# EAGLE design Toll_Controller_Unit_1st_Iteration (EAGLE 9.6.2)
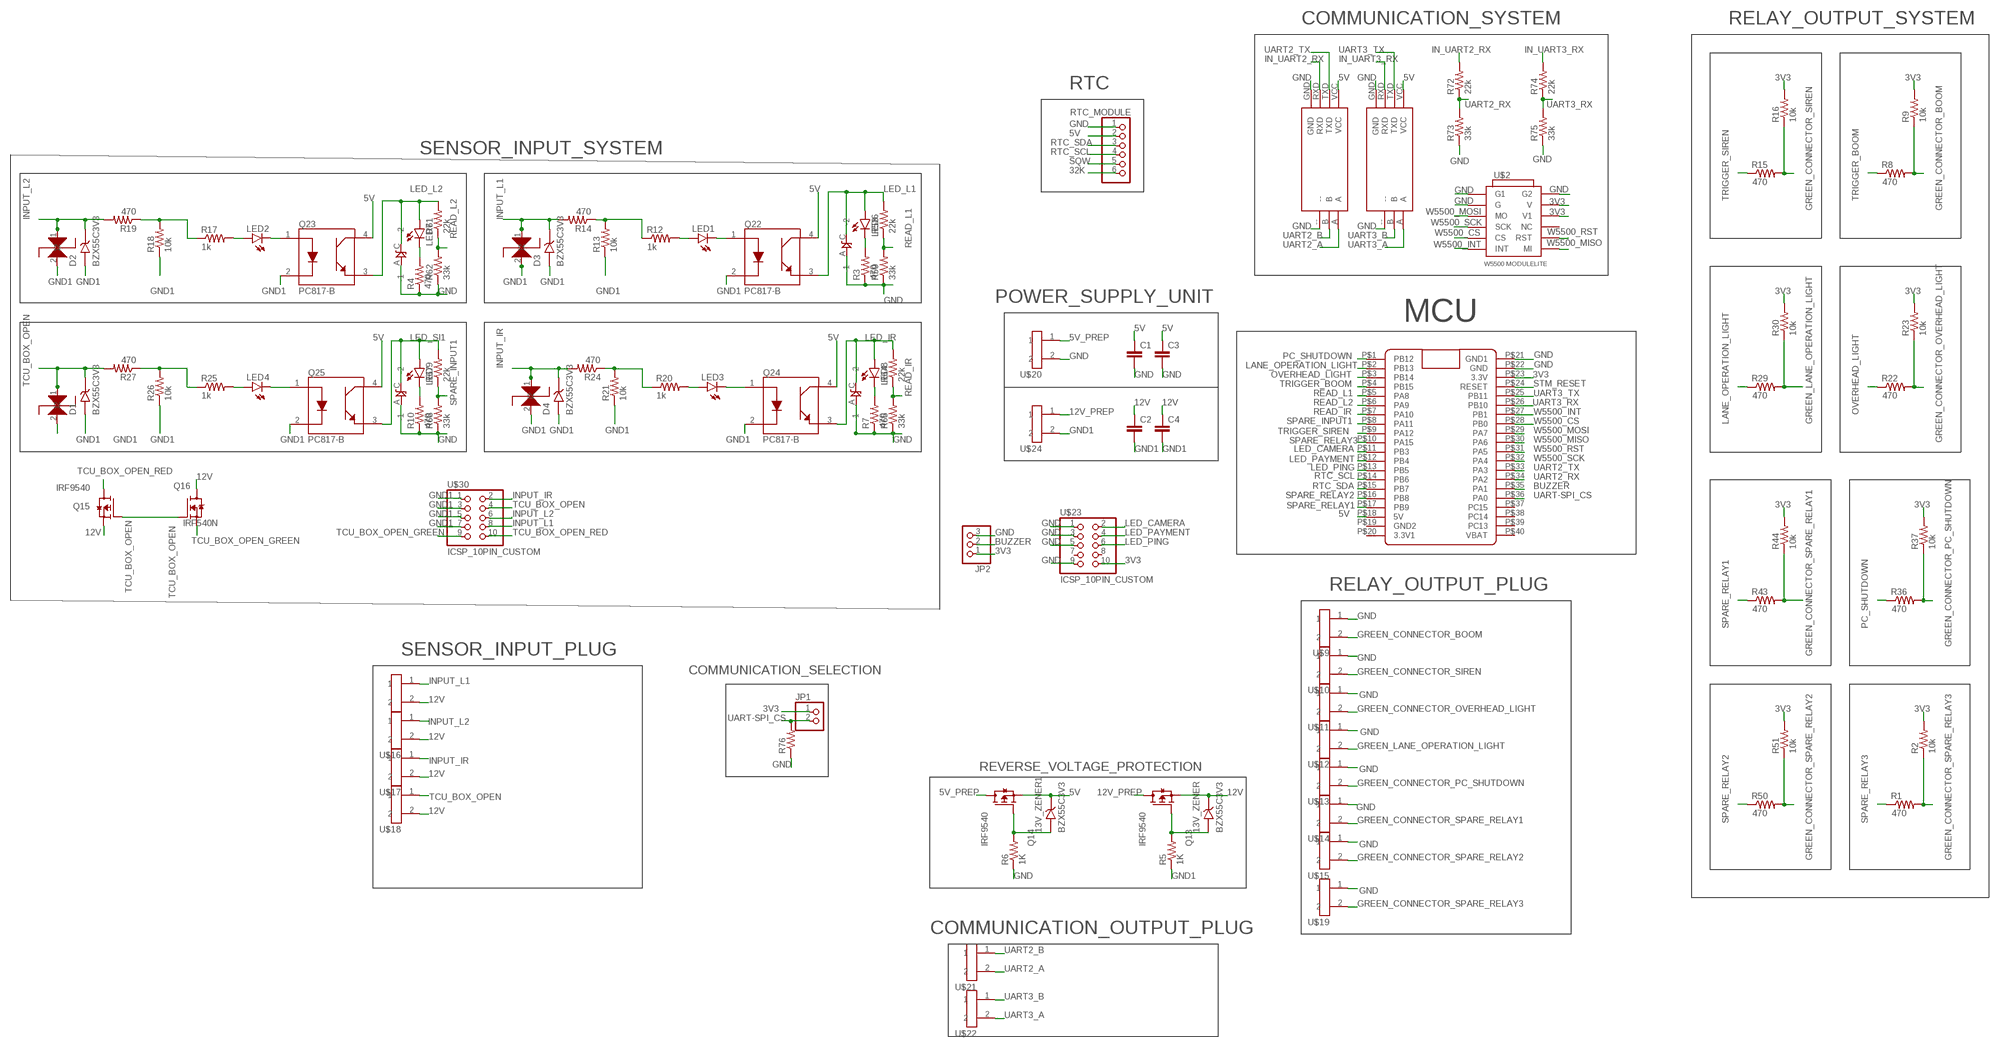
[diagram p0: schematic, sheet 1]

## Parts
13V_ZENER  BZX55C3V3  [DIOAD928W47L399D179]
13V_ZENER1  BZX55C3V3  [DIOAD928W47L399D179]
C1  CAPACITOR  [CAPACITOR]
C2  CAPACITOR  [CAPACITOR]
C3  CAPACITOR  [CAPACITOR]
C4  CAPACITOR  [CAPACITOR]
D1  BZX55C3V3  [DIOAD928W47L399D179]
D2  BZX55C3V3  [DIOAD928W47L399D179]
D3  BZX55C3V3  [DIOAD928W47L399D179]
D4  BZX55C3V3  [DIOAD928W47L399D179]
JP1  PINHD-1X2  [1X02]
JP2  PINHD-1X3  [1X03]
LED1  LED  [LED]
LED2  LED  [LED]
LED3  LED  [LED]
LED4  LED  [LED]
LED6  LED  [LED]
LED7  LED  [LED]
LED8  LED  [LED]
LED9  LED  [LED]
Q13  IRF9540  [TO254P1052X465X1989-3]
Q14  IRF9540  [TO254P1052X465X1989-3]
Q15  IRF9540  [TO254P1052X465X1989-3]
Q16  IRF540N  [TO254P1054X469X1930-3]
Q22  PC817-B  [DIP762W50P254L650H455Q4B]
Q23  PC817-B  [DIP762W50P254L650H455Q4B]
Q24  PC817-B  [DIP762W50P254L650H455Q4B]
Q25  PC817-B  [DIP762W50P254L650H455Q4B]
R1  470  RESISTOR  [RESISTOR]
R2  10k  RESISTOR  [RESISTOR]
R3  470  RESISTOR  [RESISTOR]
R4  470  RESISTOR  [RESISTOR]
R5  1K  RESISTOR  [RESISTOR]
R6  1K  RESISTOR  [RESISTOR]
R7  470  RESISTOR  [RESISTOR]
R8  470  RESISTOR  [RESISTOR]
R9  10k  RESISTOR  [RESISTOR]
R10  470  RESISTOR  [RESISTOR]
R12  1k  RESISTOR  [RESISTOR]
R13  10k  RESISTOR  [RESISTOR]
R14  470  RESISTOR  [RESISTOR]
R15  470  RESISTOR  [RESISTOR]
R16  10k  RESISTOR  [RESISTOR]
R17  1k  RESISTOR  [RESISTOR]
R18  10k  RESISTOR  [RESISTOR]
R19  470  RESISTOR  [RESISTOR]
R20  1k  RESISTOR  [RESISTOR]
R21  10k  RESISTOR  [RESISTOR]
R22  470  RESISTOR  [RESISTOR]
R23  10k  RESISTOR  [RESISTOR]
R24  470  RESISTOR  [RESISTOR]
R25  1k  RESISTOR  [RESISTOR]
R26  10k  RESISTOR  [RESISTOR]
R27  470  RESISTOR  [RESISTOR]
R29  470  RESISTOR  [RESISTOR]
R30  10k  RESISTOR  [RESISTOR]
R36  470  RESISTOR  [RESISTOR]
R37  10k  RESISTOR  [RESISTOR]
R43  470  RESISTOR  [RESISTOR]
R44  10k  RESISTOR  [RESISTOR]
R50  470  RESISTOR  [RESISTOR]
R51  10k  RESISTOR  [RESISTOR]
R58  22k  RESISTOR  [RESISTOR]
R59  33k  RESISTOR  [RESISTOR]
R61  22k  RESISTOR  [RESISTOR]
R62  33k  RESISTOR  [RESISTOR]
R64  22k  RESISTOR  [RESISTOR]
R65  33k  RESISTOR  [RESISTOR]
R67  22k  RESISTOR  [RESISTOR]
R68  33k  RESISTOR  [RESISTOR]
R72  22k  RESISTOR  [RESISTOR]
R73  33k  RESISTOR  [RESISTOR]
R74  22k  RESISTOR  [RESISTOR]
R75  33k  RESISTOR  [RESISTOR]
R76  RESISTOR  [RESISTOR]
RTC_MODULE  PINHD-1X6  [1X06]
STM_BLUEPILL  BLUE_PILL  [BLUE_PILL]
U$1  1N227B  [1N227B]
U$2  W5500_MODULELITE  [W5500_MODULELITE]
U$3  1N227B  [1N227B]
U$4  1N227B  [1N227B]
U$5  1N227B  [1N227B]
U$6  GREEN_PLUG_90_2  [GREEN_PLUG_90_2]
U$7  RS485_CHINESE  [RS485_CHINESE]
U$8  RS485_CHINESE  [RS485_CHINESE]
U$9  GREEN_PLUG_90_2  [GREEN_PLUG_90_2]
U$10  GREEN_PLUG_90_2  [GREEN_PLUG_90_2]
U$11  GREEN_PLUG_90_2  [GREEN_PLUG_90_2]
U$12  GREEN_PLUG_90_2  [GREEN_PLUG_90_2]
U$13  GREEN_PLUG_90_2  [GREEN_PLUG_90_2]
U$14  GREEN_PLUG_90_2  [GREEN_PLUG_90_2]
U$15  GREEN_PLUG_90_2  [GREEN_PLUG_90_2]
U$16  GREEN_PLUG_90_2  [GREEN_PLUG_90_2]
U$17  GREEN_PLUG_90_2  [GREEN_PLUG_90_2]
U$18  GREEN_PLUG_90_2  [GREEN_PLUG_90_2]
U$19  GREEN_PLUG_90_2  [GREEN_PLUG_90_2]
U$20  GREEN_PLUG_90_2  [GREEN_PLUG_90_2]
U$21  GREEN_PLUG_90_2  [GREEN_PLUG_90_2]
U$22  GREEN_PLUG_90_2  [GREEN_PLUG_90_2]
U$23  ICSP_10PIN_CUSTOM  [ICSP_10PIN_CUSTOM]
U$24  GREEN_PLUG_90_2  [GREEN_PLUG_90_2]
U$25  1KE100A_CUSTOM  [1KE100A_CUSTOM]
U$26  1KE100A_CUSTOM  [1KE100A_CUSTOM]
U$27  1KE100A_CUSTOM  [1KE100A_CUSTOM]
U$28  1KE100A_CUSTOM  [1KE100A_CUSTOM]
U$30  ICSP_10PIN_CUSTOM  [ICSP_10PIN_CUSTOM]

## Nets
3V3: JP1.1 JP2.1 R2.2 R9.2 R16.2 R23.2 R30.2 R37.2 R44.2 R51.2 STM_BLUEPILL.P$23(3.3V) U$2.V U$2.V1 U$23.10
5V: 13V_ZENER1.C(K) C1.1 C3.1 Q14.3(S) Q22.4(COLLECTOR) Q23.4(COLLECTOR) Q24.4(COLLECTOR) Q25.4(COLLECTOR) RTC_MODULE.2 STM_BLUEPILL.P$18(5V) U$7.VCC U$8.VCC
5V_PREP: Q14.2(D) U$20.1
12V: 13V_ZENER.C(K) C2.1 C4.1 Q13.3(S) Q15.3(S) Q16.2(D) U$6.2 U$16.2 U$17.2 U$18.2
12V_PREP: Q13.2(D) U$24.1
32K: RTC_MODULE.6
BUZZER: JP2.2 STM_BLUEPILL.P$35(PA1)
GND: C1.2 C3.2 JP2.3 R3.1 R4.1 R6.1 R7.1 R10.1 R59.1 R62.1 R65.1 R68.1 R73.1 R75.1 R76.1 RTC_MODULE.1 STM_BLUEPILL.P$21(GND1) STM_BLUEPILL.P$22(GND) U$1.A(-1) U$2.G U$2.G1 U$2.G2 U$3.A(-1) U$4.A(-1) U$5.A(-1) U$7.-- U$7.GND U$8.-- U$8.GND U$9.1 U$10.1 U$11.1 U$12.1 U$13.1 U$14.1 U$15.1 U$19.1 U$20.2 U$23.1 U$23.3 U$23.5 U$23.9
GND1: C2.2 C4.2 D1.A D2.A D3.A D4.A Q22.2(CATHODE) Q23.2(CATHODE) Q24.2(CATHODE) Q25.2(CATHODE) R5.1 R13.1 R18.1 R21.1 R26.1 U$24.2 U$25.2 U$26.2 U$30.1 U$30.3 U$30.5 U$30.7
GREEN_CONNECTOR_BOOM: R8.2 R9.1 U$9.2
GREEN_CONNECTOR_OVERHEAD_LIGHT: R22.2 R23.1 U$11.2
GREEN_CONNECTOR_PC_SHUTDOWN: R36.2 R37.1 U$13.2
GREEN_CONNECTOR_SIREN: R15.2 R16.1 U$10.2
GREEN_CONNECTOR_SPARE_RELAY1: R43.2 R44.1 U$14.2
GREEN_CONNECTOR_SPARE_RELAY2: R50.2 R51.1 U$15.2
GREEN_CONNECTOR_SPARE_RELAY3: R1.2 R2.1 U$19.2
GREEN_LANE_OPERATION_LIGHT: R29.2 R30.1 U$12.2
IN_UART2_RX: R72.2 U$8.RXD
IN_UART3_RX: R74.2 U$7.RXD
INPUT_IR: D4.C(K) R24.2 U$17.1 U$27.1 U$30.2
INPUT_L1: D3.C(K) R14.2 U$6.1 U$25.1 U$30.8
INPUT_L2: D2.C(K) R19.2 U$16.1 U$28.1 U$30.6
LANE_OPERATION_LIGHT: R29.1 STM_BLUEPILL.P$2(PB13)
LED_CAMERA: STM_BLUEPILL.P$11(PB3) U$23.2
LED_IR: LED8.A Q24.3(EMITTER) R64.2 U$4.C(-2)
LED_L1: LED6.A Q22.3(EMITTER) R58.2 U$1.C(-2)
LED_L2: LED7.A Q23.3(EMITTER) R61.2 U$3.C(-2)
LED_PAYMENT: STM_BLUEPILL.P$12(PB4) U$23.4
LED_PING: STM_BLUEPILL.P$13(PB5) U$23.6
LED_SI1: LED9.A Q25.3(EMITTER) R67.2 U$5.C(-2)
N$2: 13V_ZENER1.A Q14.1(G) R6.2
N$3: 13V_ZENER.A Q13.1(G) R5.2
N$4: LED6.K(C) R3.2
N$7: LED7.K(C) R4.2
N$8: LED8.K(C) R7.2
N$10: LED9.K(C) R10.2
N$14: LED1.A R12.2
N$16: R12.1 R13.2 R14.1
N$18: LED2.A R17.2
N$20: R17.1 R18.2 R19.1
N$22: LED3.A R20.2
N$24: R20.1 R21.2 R24.1
N$25: R25.1 R26.2 R27.1
N$26: LED4.A R25.2
N$33: LED1.K(C) Q22.1(ANODE)
N$34: LED3.K(C) Q24.1(ANODE)
N$35: LED4.K(C) Q25.1(ANODE)
N$36: LED2.K(C) Q23.1(ANODE)
OVERHEAD_LIGHT: R22.1 STM_BLUEPILL.P$3(PB14)
PC_SHUTDOWN: R36.1 STM_BLUEPILL.P$1(PB12)
READ_IR: R64.1 R65.2 STM_BLUEPILL.P$7(PA10)
READ_L1: R58.1 R59.2 STM_BLUEPILL.P$5(PA8)
READ_L2: R61.1 R62.2 STM_BLUEPILL.P$6(PA9)
RTC_SCL: RTC_MODULE.4 STM_BLUEPILL.P$14(PB6)
RTC_SDA: RTC_MODULE.3 STM_BLUEPILL.P$15(PB7)
SPARE_INPUT1: R67.1 R68.2 STM_BLUEPILL.P$8(PA11)
SPARE_RELAY1: R43.1 STM_BLUEPILL.P$17(PB9)
SPARE_RELAY2: R50.1 STM_BLUEPILL.P$16(PB8)
SPARE_RELAY3: R1.1 STM_BLUEPILL.P$10(PA15)
SQW: RTC_MODULE.5
STM_RESET: STM_BLUEPILL.P$24(RESET)
TCU_BOX_OPEN: D1.C(K) Q15.1(G) Q16.1(G) R27.2 U$18.1 U$26.1 U$30.4
TCU_BOX_OPEN_GREEN: Q16.3(S) U$30.9
TCU_BOX_OPEN_RED: Q15.2(D) U$30.10
TRIGGER_BOOM: R8.1 STM_BLUEPILL.P$4(PB15)
TRIGGER_SIREN: R15.1 STM_BLUEPILL.P$9(PA12)
UART2_A: U$8.A U$21.2
UART2_B: U$8.B U$21.1
UART2_RX: R72.1 R73.2 STM_BLUEPILL.P$34(PA2)
UART2_TX: STM_BLUEPILL.P$33(PA3) U$8.TXD
UART3_A: U$7.A U$22.2
UART3_B: U$7.B U$22.1
UART3_RX: R74.1 R75.2 STM_BLUEPILL.P$26(PB10)
UART3_TX: STM_BLUEPILL.P$25(PB11) U$7.TXD
UART-SPI_CS: JP1.2 R76.2 STM_BLUEPILL.P$36(PA0)
W5500_CS: STM_BLUEPILL.P$28(PB0) U$2.CS
W5500_INT: STM_BLUEPILL.P$27(PB1) U$2.INT
W5500_MISO: STM_BLUEPILL.P$30(PA6) U$2.MI
W5500_MOSI: STM_BLUEPILL.P$29(PA7) U$2.MO
W5500_RST: STM_BLUEPILL.P$31(PA5) U$2.RST
W5500_SCK: STM_BLUEPILL.P$32(PA4) U$2.SCK
Unconnected: STM_BLUEPILL.P$19(GND2) STM_BLUEPILL.P$20(3.3V1) STM_BLUEPILL.P$37(PC15) STM_BLUEPILL.P$38(PC14) STM_BLUEPILL.P$39(PC13) STM_BLUEPILL.P$40(VBAT) U$2.NC U$23.7 U$23.8 U$27.2 U$28.2

## Notes on the sheet
- COMMUNICATION_SYSTEM | RELAY_OUTPUT_SYSTEM
- RTC
- SENSOR_INPUT_SYSTEM
- POWER_SUPPLY_UNIT
- MCU
- RELAY_OUTPUT_PLUG
- SENSOR_INPUT_PLUG
- COMMUNICATION_SELECTION
- REVERSE_VOLTAGE_PROTECTION
- COMMUNICATION_OUTPUT_PLUG

## Library data of the parts
13V_ZENER 13V_ZENER1 D1-D4 = BZX55C3V3:BZX55C3V3: Check availability <https://pricing.snapeda.com/parts/BZX55C3V3-TR/Vishay%20Semiconductor/view-part?ref=eda>; AVAILABILITY: In Stock; CHECK_PRICES: https://www.snapeda.com/parts/BZX55C3V3-TR/Vishay/view-part/?ref=eda; DESCRIPTION: Zener Diode 3.3 V 500 mW ±6% Through Hole DO-204AH (DO-35); MF: Vishay Semiconductor; MP: BZX55C3V3-TR; PACKAGE: DO-35 NXP Semiconductors; PRICE: None; SNAPEDA_LINK: https://www.snapeda.com/parts/BZX55C3V3-TR/Vishay/view-part/?ref=snap
C1-C4 = Hand_Solder:CAPACITOR: Hand Solder Capacitor
JP1 = pinhead:PINHD-1X2: PIN HEADER
JP2 = pinhead:PINHD-1X3: PIN HEADER
LED1-LED4 LED6-LED9 = Hand_Solder:LED: LED HAND SOLDER
Q13-Q15 = IRF9540:IRF9540: Trans MOSFET P-CH 100V 6.8A 3-Pin(3+Tab) TO-220AB Check availability <https://pricing.snapeda.com/parts/IRF9540/Vishay%20Siliconix/view-part?ref=eda>; AVAILABILITY: In Stock; CHECK_PRICES: https://www.snapeda.com/parts/IRF9540/Vishay/view-part/?ref=eda; DESCRIPTION: P-Channel 100 V 19A (Tc) 3.7W (Ta), 150W (Tc) Surface Mount D²PAK (TO-263); MF: Vishay Siliconix; MP: IRF9540; PACKAGE: TO-220-3 Vishay; PRICE: None; SNAPEDA_LINK: https://www.snapeda.com/parts/IRF9540/Vishay/view-part/?ref=snap
Q16 = IRF540N:IRF540N: Check availability <https://pricing.snapeda.com/parts/IRF540N/Infineon%20Technologies/view-part?ref=eda>; AVAILABILITY: In Stock; CHECK_PRICES: https://www.snapeda.com/parts/IRF540N/Infineon/view-part/?ref=eda; DESCRIPTION: Transistor NPN MOS IRF540/IRF540N INTERNATIONAL RECTIFIER Ampere=28 V=100 TO220; MF: Infineon Technologies; MP: IRF540N; PACKAGE: Package; PRICE: None; SNAPEDA_LINK: https://www.snapeda.com/parts/IRF540N/Infineon/view-part/?ref=snap
Q22-Q25 = PC817-B:PC817-B: Check availability <https://pricing.snapeda.com/parts/PC817-B/American%20Bright/view-part?ref=eda>; AVAILABILITY: Not in stock; CHECK_PRICES: https://www.snapeda.com/parts/PC817-B/American+Bright/view-part/?ref=eda; DESCRIPTION: Phototransistors 4-DIP (0.300, 7.62mm); MF: American Bright; MP: PC817-B; PACKAGE: DIP-4 American Bright; PRICE: None; SNAPEDA_LINK: https://www.snapeda.com/parts/PC817-B/American+Bright/view-part/?ref=snap
R1-R10 R12-R27 R29 R30 R36 R37 R43 R44 R50 R51 R58 R59 R61 R62 R64 R65 R67 R68 R72-R76 = Hand_Solder:RESISTOR: Hand Solder Resistor
RTC_MODULE = pinhead:PINHD-1X6: PIN HEADER
STM_BLUEPILL = BluePill:BLUE_PILL
U$1 U$3-U$5 = 1N5227B:1N227B
U$2 = W5500_ModuleLite:W5500_MODULELITE: A custom W5500 Modulelite library made from using the datasheet link: https://nettigo.eu/products/ethernet-module-wiznet-w5500-usr-es1-w5500-lite
U$6 U$9-U$22 U$24 = Green_plug_90:GREEN_PLUG_90_2
U$7 U$8 = RS485_MOD:RS485_CHINESE
U$23 U$30 = ISCP_10PIN_CUSTOM:ICSP_10PIN_CUSTOM
U$25-U$28 = 1KE100A_CUSTOM:1KE100A_CUSTOM

## Board
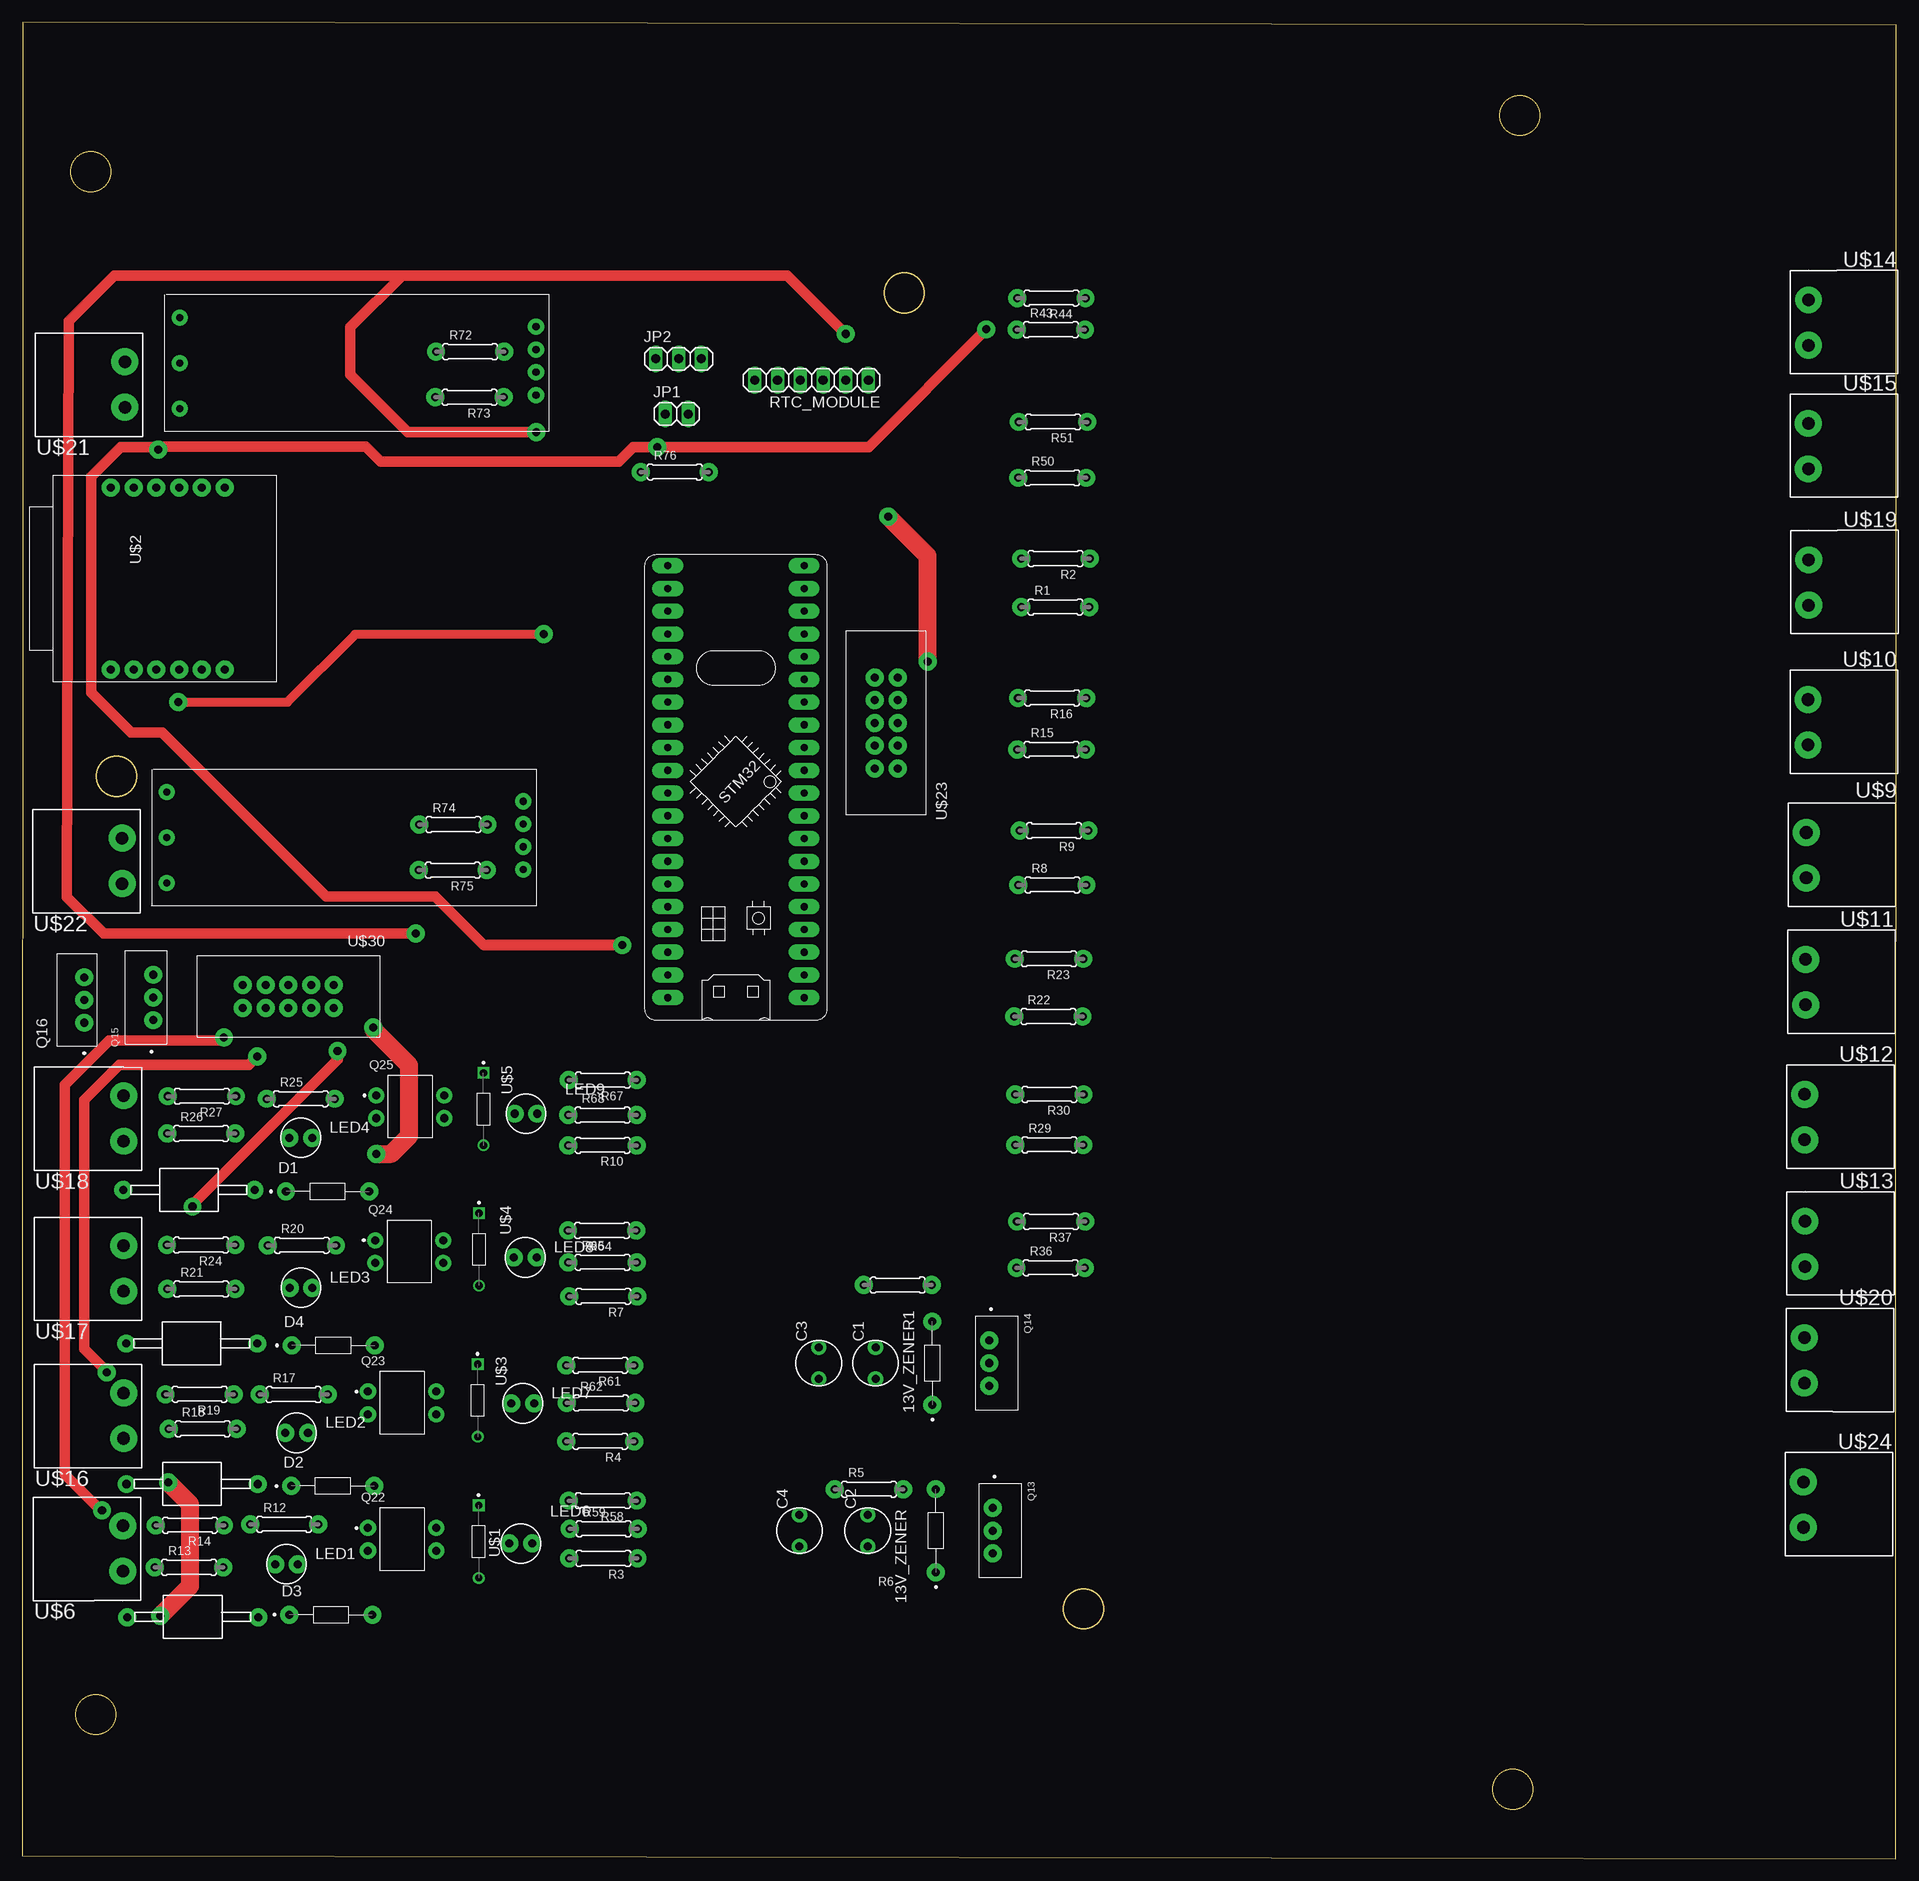
[diagram p1: board, top side]
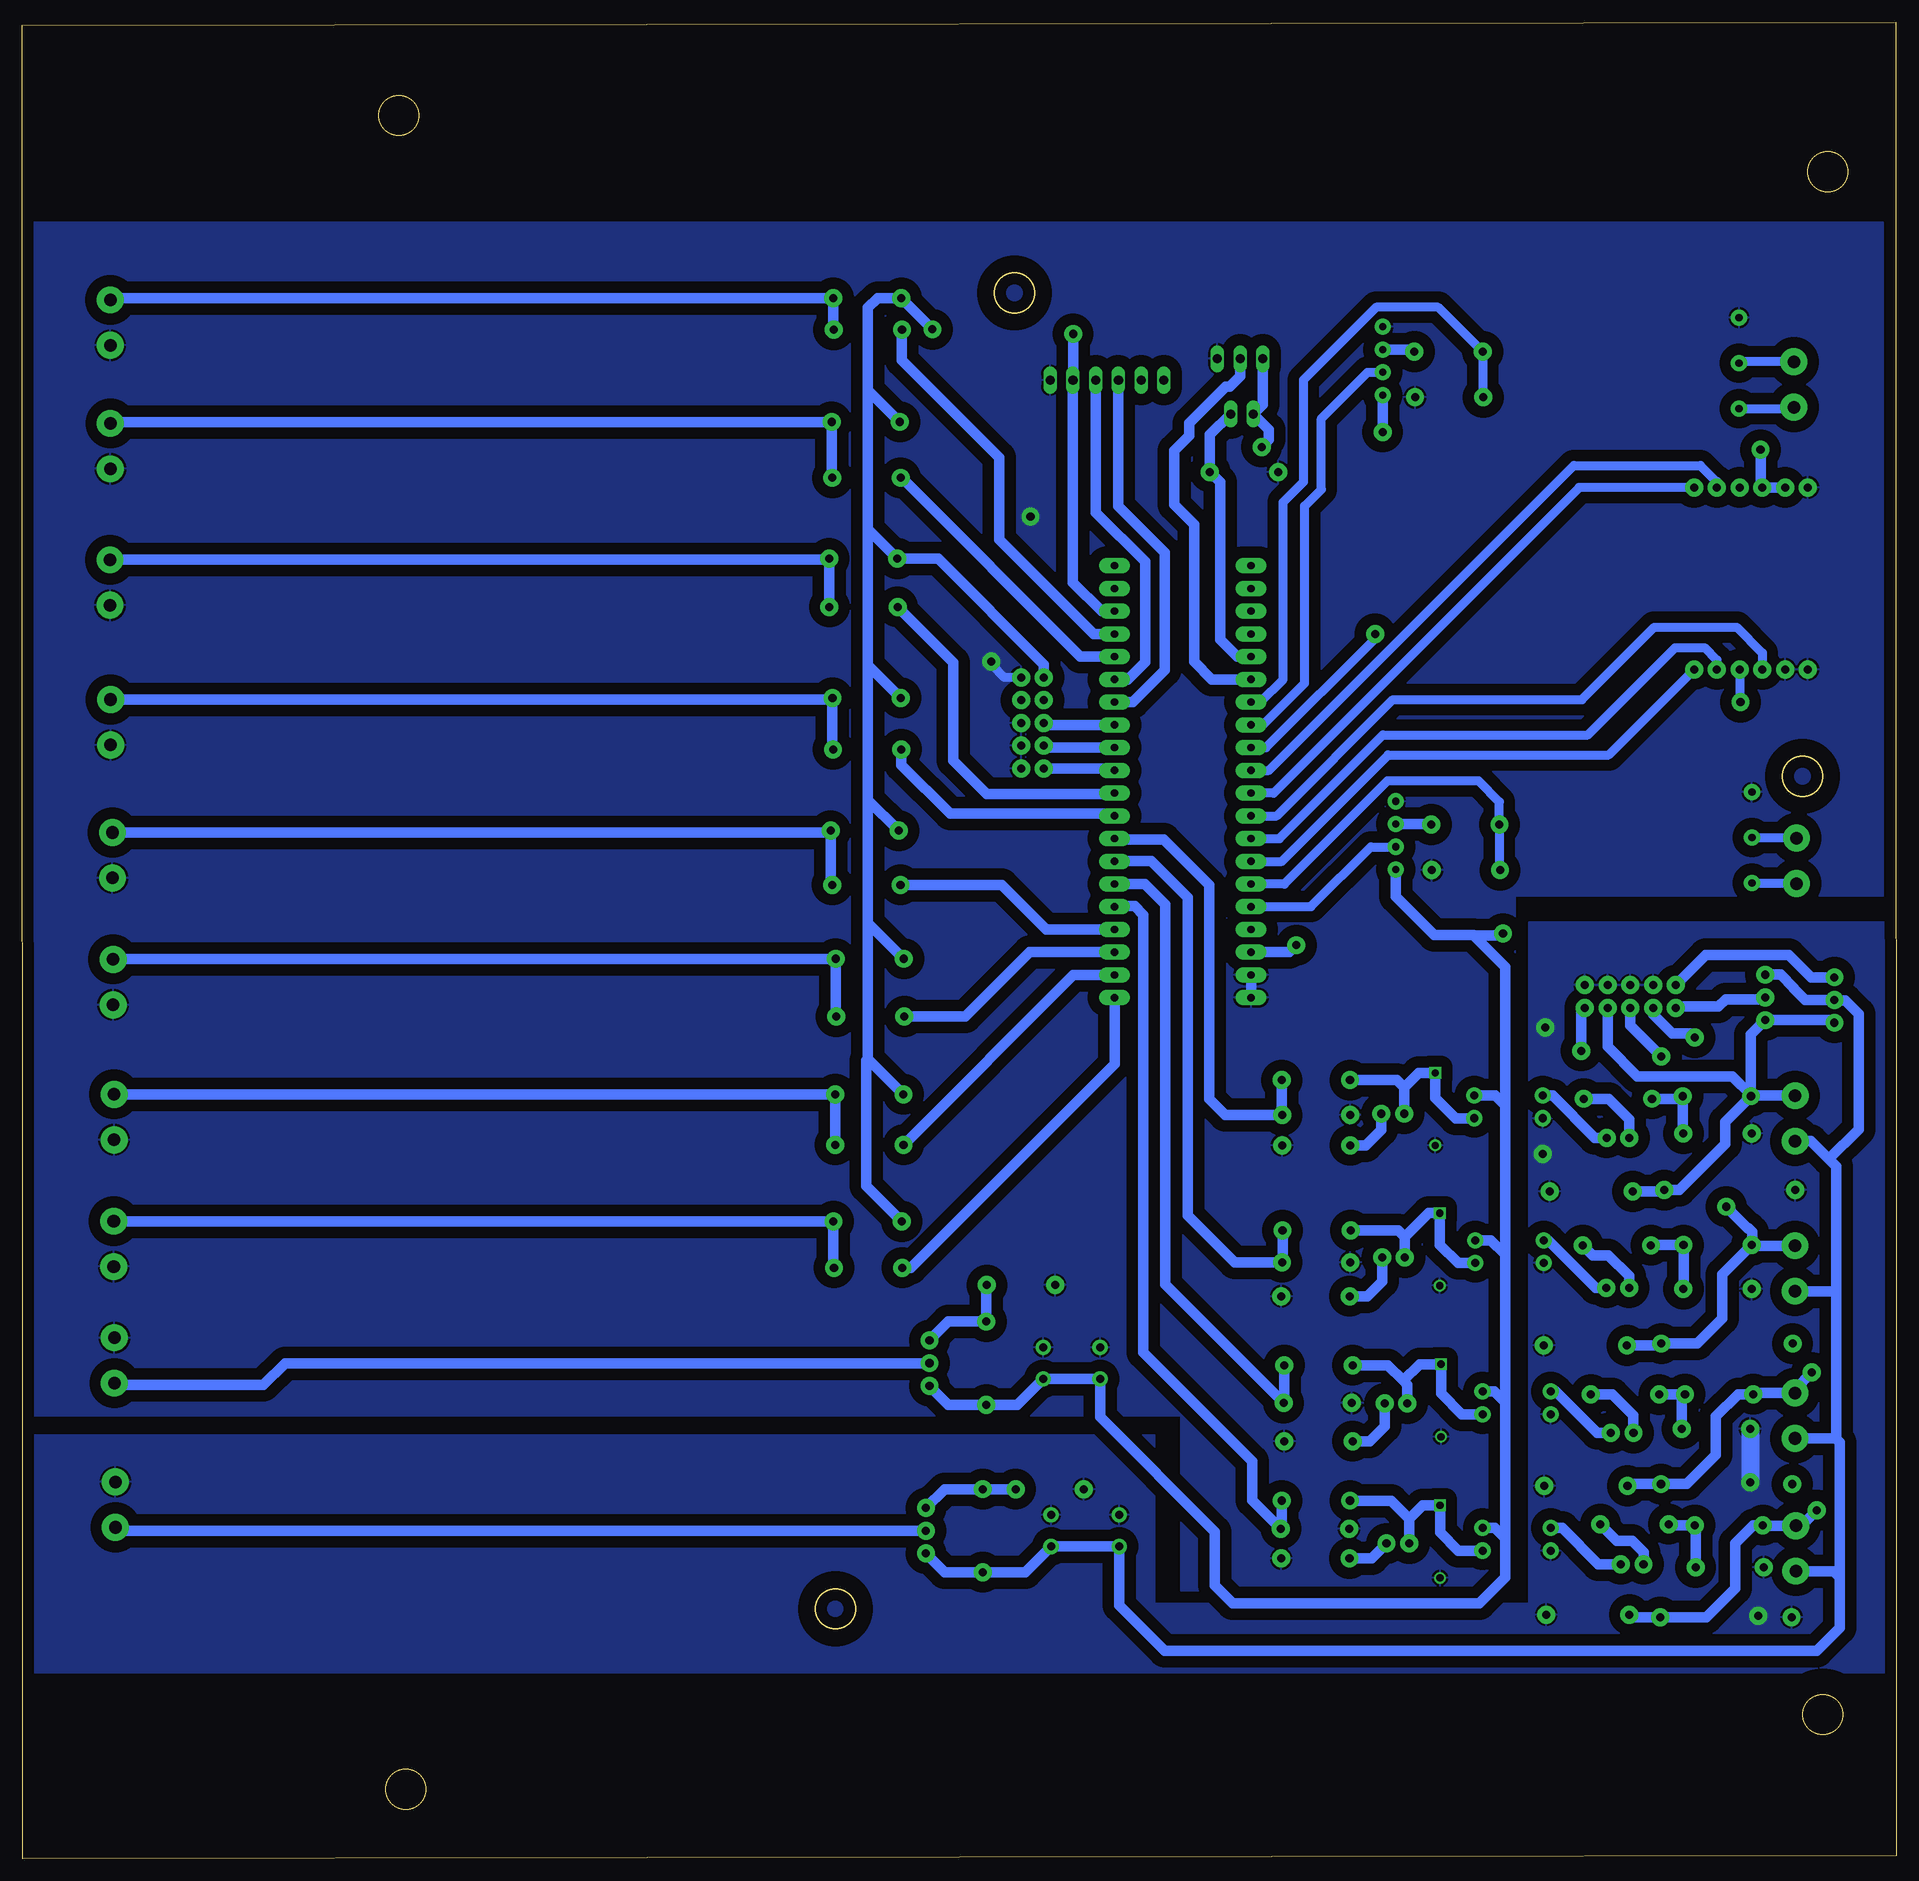
[diagram p2: board, bottom side, seen from below]

Size 209.29 x 205.13 mm. Coordinates in mm from the lower left corner, seen from the top.
Outline: 0,0.32 209.24,0 209.29,204.81 0.05,205.13 0,0.32
Outline: circle at 98.49,174.9 radius 2.24
Outline: circle at 118.49,27.9 radius 2.24
Outline: circle at 10.49,120.9 radius 2.24
Outline: circle at 8.21,16.09 radius 2.24
Outline: circle at 7.65,188.43 radius 2.24
Outline: circle at 167.24,194.73 radius 2.24
Outline: circle at 166.45,7.72 radius 2.24
Copper layers (1*16): Top 0.035mm / dielectric 1.5mm / Bottom 0.035mm
Design rules "default *": minimum track width 1mm, minimum drill 0.35mm, track to track 1mm, track to pad 0.5mm, pad to pad 0.5mm, via to via 0.5mm, smd to smd 6mil, copper to edge 40mil, drill to drill 6mil, minimum pad ring 10mil, minimum via ring 8mil, stop-mask expansion 4mil, vias tented up to drill 0mil, thermal gap 10mil
tRestrict: area 95.7,172.1 to 101.3,177.7; area 115.7,25.1 to 121.3,30.7; area 7.7,118.1 to 13.3,123.7; area 4.4,12.3 to 12,19.9; area 3.8,184.5 to 11.5,192.1; area 163.4,190.9 to 171.1,198.5; area 162.7,3.9 to 170.3,11.5
bRestrict: area 95.7,172.1 to 101.3,177.7; area 115.7,25.1 to 121.3,30.7; area 7.7,118.1 to 13.3,123.7; area 4.4,12.3 to 12,19.9; area 3.8,184.6 to 11.5,192.2; area 163.4,190.9 to 171,198.5; area 162.6,3.9 to 170.3,11.5

### Footprints (pad centres in the part's own frame; a part is rotated, then mirrored left to right if it is on the bottom)
DIOAD928W47L399D179 = drill 0.9 pad 2: A 4.64,0; C -4.64,0
CAPACITOR = drill 0.9 pad 1.7: 1 -1.77,0; 2 1.77,0
1X02 = drill 1.016 long: 1 -1.27,0; 2 1.27,0
1X03 = drill 1.016 long: 1 -2.54,0; 2 0,0; 3 2.54,0
LED = drill 0.9 pad 2: A -1.292,-0.049; K 1.248,-0.049
TO254P1052X465X1989-3 = drill 0.9 pad 2: 1 0,0; 2 2.54,0; 3 5.08,0
TO254P1054X469X1930-3 = drill 0.9 pad 2: 1 -2.54,-0.81; 2 0,-0.81; 3 2.54,-0.81
DIP762W50P254L650H455Q4B = drill 0.9 pad 1.8: 1 -3.81,1.27; 2 -3.81,-1.27; 3 3.81,-1.27; 4 3.81,1.27
RESISTOR = drill 0.9 pad 2: 1 -3.777,0.007; 2 3.843,0.007
1X06 = drill 1.016 long: 1 -6.35,0; 2 -3.81,0; 3 -1.27,0; 4 1.27,0; 5 3.81,0; 6 6.35,0
BLUE_PILL = drill 0.8 pad 1.75 long: P$1 -7.62,15.24; P$2 -7.62,12.7; P$3 -7.62,10.16; P$4 -7.62,7.62; P$5 -7.62,5.08; P$6 -7.62,2.54; P$7 -7.62,0; P$8 -7.62,-2.54; P$9 -7.62,-5.08; P$10 -7.62,-7.62; P$11 -7.62,-10.16; P$12 -7.62,-12.7; P$13 -7.62,-15.24; P$14 -7.62,-17.78; P$15 -7.62,-20.32; P$16 -7.62,-22.86; P$17 -7.62,-25.4; P$18 -7.62,-27.94; P$19 -7.62,-30.48; P$20 -7.62,-33.02; P$21 7.62,15.24; P$22 7.62,12.7; P$23 7.62,10.16; P$24 7.62,7.62; P$25 7.62,5.08; P$26 7.62,2.54; P$27 7.62,0; P$28 7.62,-2.54; P$29 7.62,-5.08; P$30 7.62,-7.62; P$31 7.62,-10.16; P$32 7.62,-12.7; P$33 7.62,-15.24; P$34 7.62,-17.78; P$35 7.62,-20.32; P$36 7.62,-22.86; P$37 7.62,-25.4; P$38 7.62,-27.94; P$39 7.62,-30.48; P$40 7.62,-33.02
1N227B = drill 0.8 pad 1.2: A 4.05,0 | drill 0.8 pad 1.2 square: C -4.05,0
W5500_MODULELITE = drill 0.9 pad 2: CS -10.09,-5.63; G -10.09,1.99; G1 -10.09,4.53; G2 10.23,4.53; INT -10.09,-8.17; MI 10.23,-8.17; MO -10.09,-0.55; NC 10.23,-3.09; RST 10.23,-5.63; SCK -10.09,-3.09; V 10.23,1.99; V1 10.23,-0.55
GREEN_PLUG_90_2 = drill 1.4 pad 3: 1 0,0; 2 0,-5.08
RS485_CHINESE = drill 0.8 pad 1.8: -- 41.3,2.54; A 41.3,12.7; B 41.3,7.62; GND 1.5,3.56; RXD 1.5,6.1; TXD 1.5,8.64; VCC 1.5,11.18
ICSP_10PIN_CUSTOM = drill 0.9 pad 2: 1 -5.08,-1.27; 2 -5.08,1.27; 3 -2.54,-1.27; 4 -2.54,1.27; 5 0,-1.27; 6 0,1.27; 7 2.54,-1.27; 8 2.54,1.27; 9 5.08,-1.27; 10 5.08,1.27
1KE100A_CUSTOM = drill 0.9 pad 2: 1 0.027,7.334; 2 0.027,-7.321

### Placement (x,y rotation side)
13V_ZENER  102.03,36.63 90 top
13V_ZENER1  101.63,55.35 90 top
C1  95.28,55.35 90 top
C2  94.41,36.63 90 top
C3  88.93,55.35 90 top
C4  86.79,36.63 90 top
D1  34.08,74.53 0 top
D2  34.66,41.63 0 top
D3  34.46,27.25 0 top
D4  34.72,57.33 0 top
JP1  73.08,161.38 0 top
JP2  73.3,167.55 0 top
LED1  29.53,32.94 0 top
LED2  30.65,47.62 0 top
LED3  31.13,63.82 0 top
LED4  31.11,80.57 0 top
LED6  55.69,35.25 0 top
LED7  55.9,50.89 0 top
LED8  56.18,67.2 0 top
LED9  56.26,83.26 0 top
Q13  108.38,39.17 270 top
Q14  107.98,57.89 270 top
Q15  14.63,93.66 90 top
Q16  6.1,95.91 90 top
Q22  42.4,35.67 0 top
Q23  42.4,50.91 0 top
Q24  43.21,67.81 0 top
Q25  43.31,83.98 0 top
R1  115.32,139.82 0 top
R2  115.41,145.24 180 top
R3  64.92,33.54 180 top
R4  64.57,46.63 180 top
R5  94.52,41.26 0 top
R6  97.72,64.07 0 top
R7  64.91,62.82 180 top
R8  115,108.76 0 top
R9  115.25,114.84 180 top
R10  64.83,79.69 180 top
R12  29.21,37.34 0 top
R13  18.57,32.53 0 top
R14  18.74,37.25 180 top
R15  114.91,123.91 0 top
R16  115.04,129.67 180 top
R17  30.26,51.84 0 top
R18  20.1,48.01 0 top
R19  19.83,51.89 180 top
R20  31.18,68.51 0 top
R21  19.94,63.63 0 top
R22  114.56,94.06 0 top
R23  114.69,100.53 180 top
R24  19.99,68.54 180 top
R25  31.06,84.88 0 top
R26  19.94,81 0 top
R27  20.08,85.17 180 top
R29  114.66,79.73 0 top
R30  114.73,85.38 180 top
R36  114.8,66 0 top
R37  114.93,71.18 180 top
R43  114.83,170.79 0 top
R44  114.96,174.35 180 top
R50  114.98,154.24 0 top
R51  115.13,160.5 180 top
R58  64.86,40 180 top
R59  64.89,36.84 0 top
R61  64.57,55.11 180 top
R62  64.59,50.88 0 top
R64  64.78,70.19 180 top
R65  64.76,66.62 0 top
R67  64.86,86.98 180 top
R68  64.76,83.05 0 top
R72  49.98,168.34 0 top
R73  49.98,163.26 180 top
R74  48.1,115.51 0 top
R75  48.1,110.43 180 top
R76  72.82,154.9 0 top
RTC_MODULE  88.15,165.16 180 top
STM_BLUEPILL  79.69,111.41 180 top
U$1  50.96,35.4 270 top
U$2  14.42,142.94 90 top
U$3  50.85,51.18 270 top
U$4  50.99,68.06 270 top
U$5  51.5,83.73 270 top
U$6  11.21,37.19 0 top
U$7  57.42,121.67 180 top
U$8  58.87,174.69 180 top
U$9  199.23,109.55 180 top
U$10  199.43,124.4 180 top
U$11  199.15,95.37 180 top
U$12  199.05,80.3 180 top
U$13  199.09,66.13 180 top
U$14  199.47,169.05 180 top
U$15  199.46,155.25 180 top
U$16  11.31,52.02 0 top
U$17  11.31,68.47 0 top
U$18  11.3,85.23 0 top
U$19  199.5,140.01 180 top
U$20  199.01,53.11 180 top
U$21  11.45,167.22 0 top
U$22  11.15,114 0 top
U$23  96.47,126.87 90 top
U$24  198.91,37 180 top
U$25  19.03,27 270 top
U$26  18.59,74.7 270 top
U$27  18.9,57.56 270 top
U$28  18.95,41.86 270 top
U$30  29.71,96.31 180 top

### Tracks (layer width: path | path; a pad name or v marks a point on that pad's centre or on a via)
3V3  (via drill 0.9 pad 2)
  Top 1.2: v107.65,170.83 94.51,157.69 v70.89,157.69 68.23,157.69 66.62,156.08 40.03,156.08 38.37,157.74 15.53,157.74 v15.17,157.38 15.48,157.69 10.97,157.69 7.69,154.41 7.69,130.24 12.15,125.78 15.62,125.78 33.93,107.47 46.1,107.47 51.54,102.04 v67,102.04
  Bottom 1.2: U$2.V U$2.V1 15.17,153.37 v15.17,157.38 | JP2.1 70.76,162.44 JP1.1 70.07,159.64 70.07,158.52 v70.89,157.69 | U$23.10 95.2,133.41 107.03,145.23 R2.2 114.85,148.51 | v107.65,170.83 111.11,174.3 R44.2 113.78,174.34 114.85,173.27 114.85,164.06 | STM_BLUEPILL.P$23 67.79,101.25 v67,102.04 | R37.2 115.07,75.15 115.07,89.14 114.86,89.35 | R23.2 114.86,104.54 | R51.2 114.85,164.06 | 114.85,148.51 114.85,164.06 | 114.85,133.32 114.85,148.51 | R16.2 114.85,133.32 | 114.85,133.32 114.85,118.28 | 114.85,118.28 R9.2 | 114.86,104.54 114.86,118.26 114.85,118.28 | 114.86,89.35 114.86,104.54 | R30.2 114.86,89.35
5V  (via drill 0.9 pad 2)
  Top 1.2: v57.38,159.36 43.02,159.36 36.62,165.76 36.62,171.06 42.41,176.85 | v91.94,170.33 85.41,176.85 42.41,176.85 | 42.41,176.85 10.28,176.85 5.2,171.77 4.96,107.44 9.07,103.33 v43.93,103.33
  Bottom 1.2: STM_BLUEPILL.P$18 88.74,139.35 91.96,142.57 RTC_MODULE.2 91.94,165.18 v91.94,170.33 | Q14.3 105.88,50.71 13V_ZENER1.C 98.15,50.71 C1.1 C3.1 88.93,49.33 76.12,36.52 76.12,30.52 74.13,28.53 46.57,28.53 43.69,31.41 43.69,35.8 | U$7.VCC 55.92,107.47 51.63,103.17 47.26,103.17 47.2,103.12 | 43.69,35.8 44.83,36.94 Q22.4 | Q23.4 44.92,52.18 43.69,50.95 | 43.69,35.8 43.69,50.95 | 43.69,50.95 43.69,67.5 | Q24.4 45.27,69.08 43.69,67.5 | 43.69,67.5 43.69,84.16 | Q25.4 44.78,85.25 43.69,84.16 | U$8.VCC v57.38,159.36 | v43.93,103.33 44.14,103.12 47.2,103.12 | 47.2,103.12 43.69,99.61 43.69,84.16
5V_PREP
  Bottom 1.2: Q14.2 179.93,55.35 182.37,52.9 198.8,52.9 U$20.1
12V
  Bottom 1.2: Q13.3 106.28,31.99 13V_ZENER.C 97.28,31.99 C2.1 C4.1 86.79,28.27 81.72,23.2 8.89,23.2 6.3,25.79 6.3,31.43 6.31,31.44 | 6.74,63.22 6.74,77.34 7.53,78.13 | 6.74,63.22 6.74,46.91 | 6.31,31.44 6.31,46.48 6.74,46.91 | U$18.2 9.54,80.15 7.53,78.13 | U$17.2 6.9,63.39 6.74,63.22 | U$16.2 6.77,46.94 6.74,46.91 | U$6.2 6.98,32.11 6.31,31.44 | Q15.3 12.92,98.74 11.45,97.27 11.45,97.2 10.18,95.93 6.93,95.93 Q16.2 6.86,95.86 5.7,95.86 4.21,94.37 4.21,81.45 7.53,78.13
12V_PREP
  Bottom 1.2: U$24.1 198.54,36.63 Q13.2
BUZZER
  Bottom 1.2: STM_BLUEPILL.P$35 76.45,131.73 78.41,133.7 78.41,149 80.67,151.26 80.67,157.27 78.97,158.97 78.97,160.36 74.9,164.43 74.45,164.43 73.3,165.59 JP2.2
GND  (via drill 0.9 pad 2)
  Top 2: v101.1,133.72 101.1,145.52 v96.7,149.92
  Bottom 1: U$23.9 99.63,131.95 101,133.32 101,133.62 v101.1,133.72
  Bottom 1.2: STM_BLUEPILL.P$22 STM_BLUEPILL.P$21
  pour Bottom (isolate 1.27): 1.49,182.79 1.49,107.52 42.62,107.52 42.62,29.89 79.84,29.89 79.84,49.43 208.95,49.43 208.95,182.79
GND1  (via drill 0.9 pad 2)
  Top 2: v39.5,78.72 41.2,78.72 43.2,80.72 43.2,88.62 39.2,92.62 v39.2,92.82 | v16.3,42.02 18.7,39.62 18.7,30.42 v15.4,27.12
  Bottom 2: R18.1 16.33,42.05 v16.3,42.02
  pour Bottom (isolate 1.27): 0.75,104.56 41.06,104.56 41.06,28.47 82.83,28.47 82.83,47.3 209.01,47.3 209.01,20.82 0.75,20.82
GREEN_CONNECTOR_BOOM
  Bottom 1.2: R8.2 119.03,108.96 R9.1 119.24,114.63 U$9.2
GREEN_CONNECTOR_OVERHEAD_LIGHT
  Bottom 1.2: R22.2 118.46,94.13 R23.1 199.08,100.52 U$11.2
GREEN_CONNECTOR_PC_SHUTDOWN
  Bottom 1.2: R36.2 118.71,66.07 R37.1 199.05,71.17 U$13.2
GREEN_CONNECTOR_SIREN
  Bottom 1.2: R15.2 118.81,123.98 R16.1 119,129.48 U$10.2
GREEN_CONNECTOR_SPARE_RELAY1
  Bottom 1.2: R43.2 118.73,170.86 R44.1 199.26,174.34 U$14.2
GREEN_CONNECTOR_SPARE_RELAY2
  Bottom 1.2: R50.2 118.91,154.33 R51.1 199.3,160.5 U$15.2
GREEN_CONNECTOR_SPARE_RELAY3
  Bottom 1.2: R1.2 119.19,139.85 R2.1 119.33,145.09 U$19.2
GREEN_LANE_OPERATION_LIGHT
  Bottom 1.2: R29.2 R30.1 U$12.2
IN_UART2_RX
  Bottom 1.2: R72.2 54.06,168.59 U$8.RXD
IN_UART3_RX
  Bottom 1.2: U$7.RXD 52,115.57 R74.2
INPUT_IR  (via drill 0.9 pad 2)
  Top 1.2: v35.2,90.23 35.2,89.27 19.95,74.02 19,73.07 v19,72.82
  Bottom 1.2: U$17.1 16.08,68.47 | 16.08,68.47 R24.2 19.43,65.25 19.43,60.33 22.24,57.53 U$27.1 26.44,57.33 D4.C | U$30.2 35.2,94.63 v35.2,90.23 | v19,72.82 16.6,70.42 16.5,70.42 16.08,70 16.08,68.47
INPUT_L1  (via drill 0.9 pad 2)
  Top 1.2: v22.51,91.72 22.17,91.38 9.69,91.38 4.73,86.42 4.73,42.9 8.59,39.04 8.76,39.04 v8.89,38.91 | v8.89,38.91
  Bottom 1.2: v8.89,38.91 10.61,37.19 U$6.1 14.85,37.19 R14.2 15.99,37.24 18.02,35.22 18.02,30.2 21.24,26.97 U$25.1 29.54,26.97 D3.C | U$30.8 27.17,94.27 25.05,92.16 22.95,92.16 v22.51,91.72
INPUT_L2  (via drill 0.9 pad 2)
  Top 1.2: v26.24,89.59 25.3,88.64 10.8,88.64 6.93,84.77 6.93,56.92 9.44,54.41 v9.44,54.31
  Bottom 1.2: v9.44,54.31 11.31,52.43 U$16.1 15.84,52.02 R19.2 17.65,51.88 20.15,49.39 20.15,45.1 23.41,41.84 U$28.1 29.82,41.84 D2.C | U$30.6 29.71,93.06 v26.24,89.59
LANE_OPERATION_LIGHT
  Bottom 1.2: STM_BLUEPILL.P$2 91.91,98.71 R29.1
LED_CAMERA
  Bottom 1.2: U$23.2 87.53,121.79 STM_BLUEPILL.P$11
LED_IR
  Bottom 1.2: R64.2 55.63,70.18 54.89,69.43 | 54.89,69.43 LED8.A | 54.89,69.43 52.21,72.11 U$4.C 50.99,68.57 48.95,66.54 Q24.3
LED_L1
  Bottom 1.2: R58.2 56.39,39.99 54.38,37.97 | 54.38,37.97 54.38,35.22 LED6.A | 54.38,37.97 52.89,39.45 U$1.C 50.96,36.44 48.92,34.4 Q22.3
LED_L2
  Bottom 1.2: R61.2 56.78,55.11 55.07,53.39 | LED7.A 54.6,52.93 55.07,53.39 | 55.07,53.39 53.23,55.23 U$3.C 50.85,51.95 48.54,49.64 Q23.3
LED_PAYMENT
  Bottom 1.2: U$23.4 94.98,124.11 STM_BLUEPILL.P$12
LED_PING
  Bottom 1.2: U$23.6 94.98,126.65 STM_BLUEPILL.P$13
LED_SI1
  Bottom 1.2: 54.97,86.15 LED9.A | 54.97,86.15 53.34,87.78 U$5.C 51.5,85 49.21,82.71 Q25.3 | R67.2 55.79,86.97 54.97,86.15
N$2
  Bottom 1.2: Q14.1 105.88,59.99 13V_ZENER1.A 101.63,64.01 R6.2
N$3
  Bottom 1.2: Q13.1 106.28,41.27 13V_ZENER.A 102.02,41.26 R5.2
N$4
  Bottom 1.2: LED6.K 58.6,33.53 R3.2
N$7
  Bottom 1.2: R4.2 58.79,46.62 57.14,48.27 LED7.K
N$8
  Bottom 1.2: R7.2 59.1,62.82 57.43,64.49 LED8.K
N$10
  Bottom 1.2: R10.2 59.23,79.68 57.51,81.41 LED9.K
N$14
  Bottom 1.2: R12.2 31.21,35.51 29.51,35.51 28.23,34.24 LED1.A
N$16
  Bottom 1.2: R12.1 25.32,37.24 R14.1 22.42,37.14 R13.2
N$18
  Bottom 1.2: R17.2 31.71,51.84 29.36,49.49 LED2.A
N$20
  Bottom 1.2: R17.1 23.64,51.84 R19.1 23.95,51.54 R18.2
N$22
  Bottom 1.2: R20.2 33.9,67.4 32.18,67.4 29.84,65.07 LED3.A
N$24
  Bottom 1.2: R20.1 27.39,68.54 R24.1 23.77,63.65 R21.2
N$25
  Bottom 1.2: R25.1 24.14,84.88 R27.1 23.85,81.09 R26.2
N$26
  Bottom 1.2: R25.2 32.11,84.88 29.82,82.6 LED4.A
N$33
  Bottom 1.2: Q22.1 37.33,36.94 33.28,32.89 LED1.K
N$34
  Bottom 1.2: Q24.1 38.89,69.08 33.58,63.77 LED3.K
N$35
  Bottom 1.2: Q25.1 38.39,85.25 33.66,80.52 LED4.K
N$36
  Bottom 1.2: LED2.K 33.41,47.57 38.02,52.18 Q23.1
OVERHEAD_LIGHT
  Bottom 1.2: R22.1 103.99,94.07 96.8,101.25 STM_BLUEPILL.P$3
PC_SHUTDOWN
  Bottom 1.2: STM_BLUEPILL.P$1 87.31,88.77 110.08,66.01 R36.1
READ_IR
  Bottom 1.2: STM_BLUEPILL.P$7 87.27,111.45 83.21,111.45 79.12,107.35 79.12,71.82 73.91,66.62 R65.2 68.55,66.67 R64.1
READ_L1
  Bottom 1.2: STM_BLUEPILL.P$5 87.25,106.39 85.07,106.39 84.1,105.41 84.1,56.53 71.93,44.37 71.93,40.05 R59.2 68.63,36.94 R58.1
READ_L2
  Bottom 1.2: STM_BLUEPILL.P$6 87.29,108.89 83.96,108.89 81.66,106.59 81.66,64.12 R62.2 68.35,50.97 R61.1
RTC_SCL
  Bottom 1.2: STM_BLUEPILL.P$14 85.26,129.19 81.69,132.76 81.69,145.89 86.88,151.08 RTC_MODULE.4
RTC_SDA
  Bottom 1.2: STM_BLUEPILL.P$15 85.83,131.73 83.9,133.66 83.9,144.87 89.42,150.38 RTC_MODULE.3
SPARE_INPUT1
  Bottom 1.2: STM_BLUEPILL.P$8 87.22,113.86 81.82,113.86 76.74,108.77 76.74,84.86 74.94,83.06 R68.2 68.64,83.09 R67.1
SPARE_RELAY1
  Bottom 1.2: R43.1 111.05,167.37 100.18,156.5 100.18,147.37 89.62,136.81 STM_BLUEPILL.P$17
SPARE_RELAY2
  Bottom 1.2: STM_BLUEPILL.P$16 91.12,134.27 111.1,154.25 R50.1
SPARE_RELAY3
  Bottom 1.2: R1.1 105.35,133.63 105.35,122.69 101.6,118.93 87.41,118.93 STM_BLUEPILL.P$10
TCU_BOX_OPEN
  Bottom 1.2: D1.C 26.07,74.53 U$26.1 24.27,74.68 19.12,79.83 19.12,82.29 R27.2 | U$30.4 32.25,90.71 28.92,87.39 18.34,87.39 16.17,85.23 | Q16.1 7.2,93.66 Q15.1 16.23,92.05 R27.2 | U$18.1 16.17,85.23 | 16.17,85.23 R27.2
TCU_BOX_OPEN_GREEN
  Bottom 1.2: U$30.9 21.27,100.94 12.01,100.94 9.53,98.45 Q16.3
TCU_BOX_OPEN_RED
  Bottom 1.2: U$30.10 24.49,95.18 19.88,95.18 19.07,96 14.83,96 Q15.2
TRIGGER_BOOM
  Bottom 1.2: STM_BLUEPILL.P$4 94.93,103.79 99.91,108.77 R8.1
TRIGGER_SIREN
  Bottom 1.2: R15.1 111.13,122.18 105.69,116.73 87.55,116.73 STM_BLUEPILL.P$9
UART2_A
  Bottom 1: U$8.A 11.61,161.99 U$21.2
UART2_B
  Bottom 1: U$21.1 17.41,167.22 U$8.B
UART2_RX
  Bottom 1: STM_BLUEPILL.P$34 71.02,129.19 68.48,131.73 68.48,151.52 66.23,153.77 66.23,165.18 58.09,173.31 51.17,173.31 R72.1 46.2,163.31
  Bottom 1.2: 46.2,163.31 R73.2
UART2_TX
  Bottom 1: STM_BLUEPILL.P$33 72.03,126.69 70.69,126.69 66.08,131.3 66.08,151.09 64.23,152.94 64.23,160.88 59.06,166.05 U$8.TXD
UART3_A
  Bottom 1: U$7.A 11.19,108.97 U$22.2
UART3_B
  Bottom 1: U$7.B 11.19,114.05 U$22.1
UART3_RX
  Bottom 1: 44.32,110.49 R74.1 44.32,118.06 46.65,120.38 56.83,120.38 68.34,108.87 STM_BLUEPILL.P$26
  Bottom 1.2: 44.32,110.49 R75.2
UART3_TX
  Bottom 1: U$7.TXD 58.68,113.03 65.38,106.33 STM_BLUEPILL.P$25
UART-SPI_CS
  Bottom 1.2: STM_BLUEPILL.P$36 73.63,134.27 75.53,136.18 75.53,153.78 R76.2 76.67,159.07 JP1.2
W5500_CS
  Bottom 1: STM_BLUEPILL.P$28 68.91,113.95 57.33,125.53 34.46,125.53 24.71,135.28 21.41,135.28 20.05,133.92 U$2.CS
W5500_INT
  Bottom 1: STM_BLUEPILL.P$27 68.62,111.41 56.75,123.29 32.14,123.29 U$2.INT
W5500_MISO
  Bottom 1: U$2.MI 35.42,153.17 69.55,119.03 STM_BLUEPILL.P$30
W5500_MOSI
  Bottom 1: STM_BLUEPILL.P$29 69.2,116.49 56.23,129.46 35.13,129.46 27.03,137.56 17.83,137.56 14.97,134.69 U$2.MO
W5500_RST
  Bottom 1: STM_BLUEPILL.P$31 70.08,121.57 36.01,155.64 21.9,155.64 20.05,153.79
  Bottom 1.2: 20.05,153.79 U$2.RST
W5500_SCK  (via drill 0.9 pad 2)
  Top 1: v58.21,136.81 58.21,136.75 37.15,136.75 29.6,129.19 v17.4,129.19
  Bottom 1: U$2.SCK 17.51,129.3 | STM_BLUEPILL.P$32 70.41,124.11 58.21,136.31 v58.21,136.81
  Bottom 1.2: 17.51,129.3 v17.4,129.19

### Text on the board
tDocu: MADE IN BANGLADESH